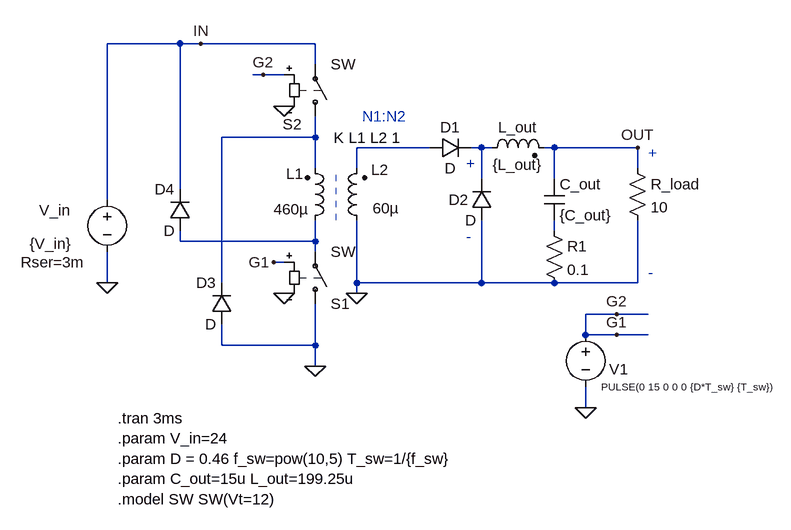
[diagram p0: schematic forward-converter-generic.asc]
forward-converter-generic.asc, the LTspice schematic file:
Version 4
SHEET 1 1880 832
WIRE -3936 -2000 -4048 -2000
WIRE -3904 -2000 -3936 -2000
WIRE -3728 -2000 -3904 -2000
WIRE -3728 -1968 -3728 -2000
WIRE -3808 -1952 -3824 -1952
WIRE -3776 -1952 -3808 -1952
WIRE -3728 -1856 -3728 -1888
WIRE -3728 -1856 -3872 -1856
WIRE -3552 -1840 -3664 -1840
WIRE -3472 -1840 -3488 -1840
WIRE -3456 -1840 -3472 -1840
WIRE -3360 -1840 -3376 -1840
WIRE -3232 -1840 -3360 -1840
WIRE -3728 -1808 -3728 -1856
WIRE -3664 -1808 -3664 -1840
WIRE -3232 -1808 -3232 -1840
WIRE -3472 -1792 -3472 -1840
WIRE -3360 -1792 -3360 -1840
WIRE -3936 -1776 -3936 -2000
WIRE -4048 -1760 -4048 -2000
WIRE -3360 -1712 -3360 -1728
WIRE -3936 -1696 -3936 -1712
WIRE -3728 -1696 -3728 -1728
WIRE -3728 -1696 -3936 -1696
WIRE -3728 -1680 -3728 -1696
WIRE -3776 -1664 -3792 -1664
WIRE -4048 -1632 -4048 -1680
WIRE -3872 -1632 -3872 -1856
WIRE -3664 -1632 -3664 -1728
WIRE -3472 -1632 -3472 -1728
WIRE -3472 -1632 -3664 -1632
WIRE -3360 -1632 -3472 -1632
WIRE -3232 -1632 -3232 -1728
WIRE -3232 -1632 -3360 -1632
WIRE -3664 -1616 -3664 -1632
WIRE -3264 -1584 -3312 -1584
WIRE -3216 -1584 -3264 -1584
WIRE -3312 -1552 -3312 -1584
WIRE -3264 -1552 -3312 -1552
WIRE -3216 -1552 -3264 -1552
WIRE -3872 -1536 -3872 -1568
WIRE -3728 -1536 -3728 -1600
WIRE -3728 -1536 -3872 -1536
WIRE -3728 -1504 -3728 -1536
WIRE -3312 -1440 -3312 -1472
FLAG -3728 -1504 0
FLAG -4048 -1632 0
FLAG -3904 -2000 IN
FLAG -3232 -1840 OUT
FLAG -3664 -1616 0
FLAG -3312 -1440 0
FLAG -3792 -1664 G1
FLAG -3264 -1552 G1
FLAG -3264 -1584 G2
FLAG -3808 -1952 G2
FLAG -3776 -1616 0
FLAG -3776 -1904 0
SYMBOL voltage -4048 -1776 R0
WINDOW 123 0 0 Left 0
WINDOW 39 -133 112 Left 2
WINDOW 0 -105 32 Left 2
WINDOW 3 -119 84 Left 2
SYMATTR SpiceLine Rser=3m
SYMATTR InstName V_in
SYMATTR Value {V_in}
SYMBOL res -3248 -1824 R0
SYMATTR InstName R_load
SYMATTR Value 10
SYMBOL ind2 -3648 -1712 R180
WINDOW 0 -33 94 Left 2
WINDOW 3 -49 35 Left 2
SYMATTR InstName L2
SYMATTR Value 60µ
SYMATTR Type ind
SYMATTR SpiceLine Rser=3u
SYMBOL ind2 -3744 -1712 M180
WINDOW 0 -29 88 Left 2
WINDOW 3 -48 33 Left 2
SYMATTR InstName L1
SYMATTR Value 460µ
SYMATTR Type ind
SYMATTR SpiceLine Rser=3u
SYMBOL voltage -3312 -1568 R0
WINDOW 0 36 69 Left 2
WINDOW 3 24 96 Left 1
WINDOW 123 0 0 Left 0
WINDOW 39 0 0 Left 0
SYMATTR InstName V1
SYMATTR Value PULSE(0 15 0 0 0 {D*T_sw} {T_sw})
SYMBOL diode -3552 -1824 R270
WINDOW 0 32 32 VTop 2
WINDOW 3 0 32 VBottom 2
SYMATTR InstName D1
SYMBOL cap -3376 -1792 R0
SYMATTR InstName C_out
SYMATTR Value {C_out}
SYMBOL ind2 -3472 -1824 R270
WINDOW 0 32 56 VTop 2
WINDOW 3 5 56 VBottom 2
SYMATTR InstName L_out
SYMATTR Value {L_out}
SYMATTR Type ind
SYMBOL diode -3456 -1728 R180
WINDOW 0 36 32 Left 2
WINDOW 3 24 0 Left 2
SYMATTR InstName D2
SYMBOL diode -3856 -1568 R180
WINDOW 0 24 64 Left 2
WINDOW 3 24 0 Left 2
SYMATTR InstName D3
SYMBOL diode -3920 -1712 R180
WINDOW 0 24 64 Left 2
WINDOW 3 24 0 Left 2
SYMATTR InstName D4
SYMBOL res -3376 -1728 R0
SYMATTR InstName R1
SYMATTR Value 0.1
SYMBOL sw -3728 -1584 M180
SYMATTR InstName S1
SYMBOL sw -3728 -1872 M180
WINDOW 0 -50 4 Left 2
SYMATTR InstName S2
TEXT -3648 -1840 Bottom 2 !K L1 L2 1
TEXT -4032 -1424 Left 2 !.tran 3ms\n.param V_in=24\n.param D = 0.46 f_sw=pow(10,5) T_sw=1/{f_sw}\n.param C_out=15u L_out=199.25u\n.model SW SW(Vt=12)
TEXT -3496 -1816 Left 2 ;+
TEXT -3496 -1704 Left 2 ;-
TEXT -3216 -1832 Left 2 ;+
TEXT -3216 -1648 Left 2 ;-
TEXT -3656 -1888 Left 2 ;N1:N2
LINE Normal -3696 -1728 -3696 -1808 2

The netlist it stands for:
* forward-converter-generic.asc
V_in IN 0 {V_in} Rser=3m
R_load OUT 0 10
L2 0 N002 60µ Rser=3u
L1 N005 N001 460µ Rser=3u
V1 G2 0 PULSE(0 15 0 0 0 {D*T_sw} {T_sw})
D1 N002 N003 D
C_out OUT N004 {C_out}
L_out N003 OUT {L_out}
D2 0 N003 D
D3 0 N001 D
D4 N005 IN D
R1 N004 0 0.1
S1 0 N005 G2 0 SW
S2 N001 IN G2 0 SW
.model D D
.lib standard.dio
K L1 L2 1
.tran 3ms
.param V_in=24
.param D = 0.46 f_sw=pow(10,5) T_sw=1/{f_sw}
.param C_out=15u L_out=199.25u
.model SW SW(Vt=12)
* +
* -
* +
* -
* N1:N2
.backanno
.end